# Altium schematic sheet Relay.SchDoc
size A4; SheetNumber: 6; SheetTotal: 8
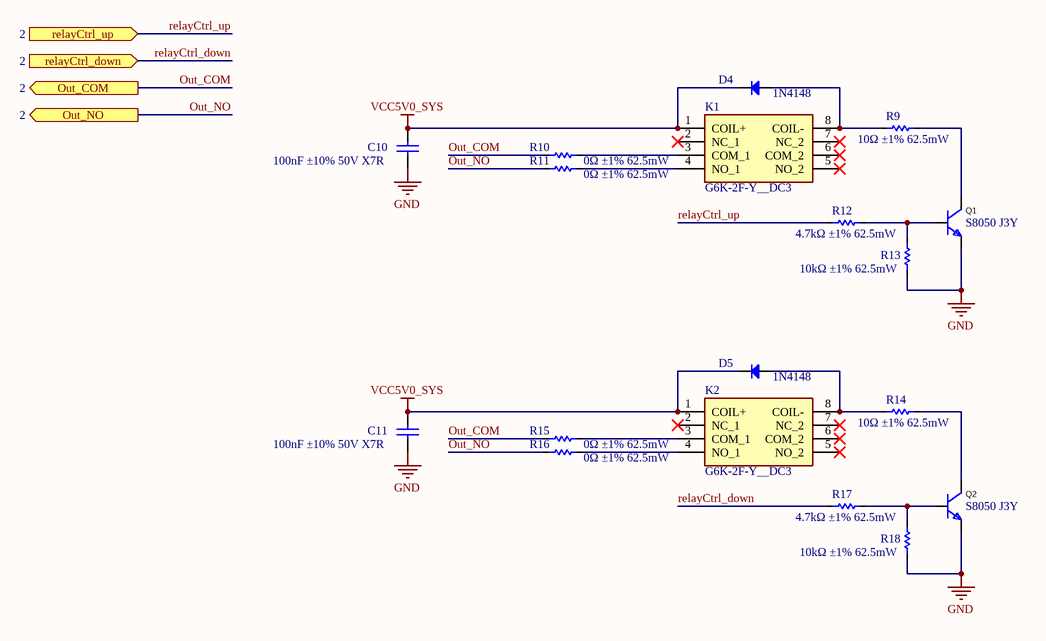
[diagram p0: Relay.SchDoc]

## Parts
C10  100nF ±10% 50V X7R  [C0603]
C11  100nF ±10% 50V X7R  [C0603]
D4  1N4148  [SMA_L4.3-W2.6-LS5.2-RD]
D5  1N4148  [SMA_L4.3-W2.6-LS5.2-RD]
K1  G6K-2F-Y__DC3  [G6K2FYDC3]
K2  G6K-2F-Y__DC3  [G6K2FYDC3]
Q1  S8050 J3Y  [SOT95P240X110-3N]
Q2  S8050 J3Y  [SOT95P240X110-3N]
R9  10Ω ±1% 62.5mW  [R0402]
R10  0Ω ±1% 62.5mW  [R0402]
R11  0Ω ±1% 62.5mW  [R0402]
R12  4.7kΩ ±1% 62.5mW  [R0402]
R13  10kΩ ±1% 62.5mW  [R0402]
R14  10Ω ±1% 62.5mW  [R0402]
R15  0Ω ±1% 62.5mW  [R0402]
R16  0Ω ±1% 62.5mW  [R0402]
R17  4.7kΩ ±1% 62.5mW  [R0402]
R18  10kΩ ±1% 62.5mW  [R0402]

## Ports
Out_COM (out, see 2), Out_NO (out, see 2), relayCtrl_down (in, see 2), relayCtrl_up (in, see 2)

## Nets
GND: C10.1 C11.1 Q1.2(E) Q2.2(E) R13.1 R18.1
VCC5V0_SYS: C10.2 C11.2 D4.2(K) D5.2(K) K1.1(COIL+) K2.1(COIL+)
Out_COM: R10.2 R15.2 ; port Out_COM
Out_NO: R11.2 R16.2 ; port Out_NO
relayCtrl_down: R17.1 ; port relayCtrl_down
relayCtrl_up: R12.1 ; port relayCtrl_up
NetD4_1: D4.1(A) K1.8(COIL-) R9.2
NetD5_1: D5.1(A) K2.8(COIL-) R14.2
NetK1_3: K1.3(COM_1) R10.1
NetK1_4: K1.4(NO_1) R11.1
NetK2_3: K2.3(COM_1) R15.1
NetK2_4: K2.4(NO_1) R16.1
NetQ1_1: Q1.1(B) R12.2 R13.2
NetQ1_3: Q1.3(C) R9.1
NetQ2_1: Q2.1(B) R17.2 R18.2
NetQ2_3: Q2.3(C) R14.1

Not connected (* = marked no-connect by the designer): K1 2(NC_1)* 5(NO_2)* 6(COM_2)* 7(NC_2)*; K2 2(NC_1)* 5(NO_2)* 6(COM_2)* 7(NC_2)*

## Library data of the parts
C10 C11 = C0603: CC0603KRX7R9BB104; Published: 8-Jun-2000; LatestRevisionDate: 17-Jul-2002; LatestRevisionNote: Re-released for DXP Platform.; PackageReference: RAD-0.3; Publisher: Altium Limited; PackageDescription: Radial Cap, Thru-Hole; 2 Leads; 0.3 in Pin Spacing
D4 D5 = Diode: High Conductance Fast Diode; Published: 8-Jun-2000; LatestRevisionDate: 17-Jul-2002; LatestRevisionNote: Re-released for DXP Platform.; DatasheetVersion: 1997; PackageReference: DO-35; Publisher: Altium Limited; PackageDescription: Diode, Axial; Body 3.8 x 1.9 mm (LxDia. max), Lead Dia. 0.53 mm (max); Code_JEDEC: DO-204-AH; ComponentLink1Description: Manufacturer Link; ComponentLink1URL: http://www.fairchildsemi.com/; ComponentLink2Description: Datasheet; ComponentLink2URL: http://www.fairchildsemi.com/ds/1N%2F1N4148.pdf
K1 K2 = G6K-2F-Y__DC3: Relay or Contactor; Manufacturer_Name: Omron Electronics; Manufacturer_Part_Number: G6K-2F-Y  DC3; Datasheet Link: https://omronfs.omron.com/en_US/ecb/products/pdf/en-g6k.pdf; Height: 5.4mm
Q1 Q2 = S8050: Manufacturer: CJ(江苏长电/长晶); Name: SS8050; Symbol: SS8050_C2150; Add into BOM: yes; Transistor Type: NPN; Collector-Emitter Breakdown Voltage (Vceo): 25V; Collector Current (Ic): 1.5A; Power Dissipation (Pd): 300mW; Collector Cut-Off Current (Icbo): 100nA; Collector-Emitter Saturation Voltage (VCE(sat)@Ic,Ib): 500mV@800mA,80mA; DC Current Gain (hFE@Ic,Vce): 200@100mA,1V; Transition Frequency (fT): 100MHz; Device: SS8050_C2150; LCSC Part Name: NPN 25V 1.5A Y1 200-350; Supplier Part: C2150; Manufacturer Part: SS8050; Supplier Footprint: SOT-23; JLCPCB Part Class: Basic Part; Datasheet: https://atta.szlcsc.com/upload/public/pdf/source/20230322/AEE86F4B043774EFF80CAEA14A37D9E9.pdf; Supplier: LCSC; Convert to PCB: yes; Operating Temperature: +150℃@(Tj)
R9-R18 = R0402: Resistor; Published: 8-Jun-2000; LatestRevisionDate: 17-Jul-2002; LatestRevisionNote: Re-released for DXP Platform.; PackageReference: AXIAL-0.3; Publisher: Altium Limited; PackageDescription: Axial Device, Thru-Hole; 2 Leads; 0.3 in Pin Spacing